# EAGLE design NanOSD (EAGLE 6.4)
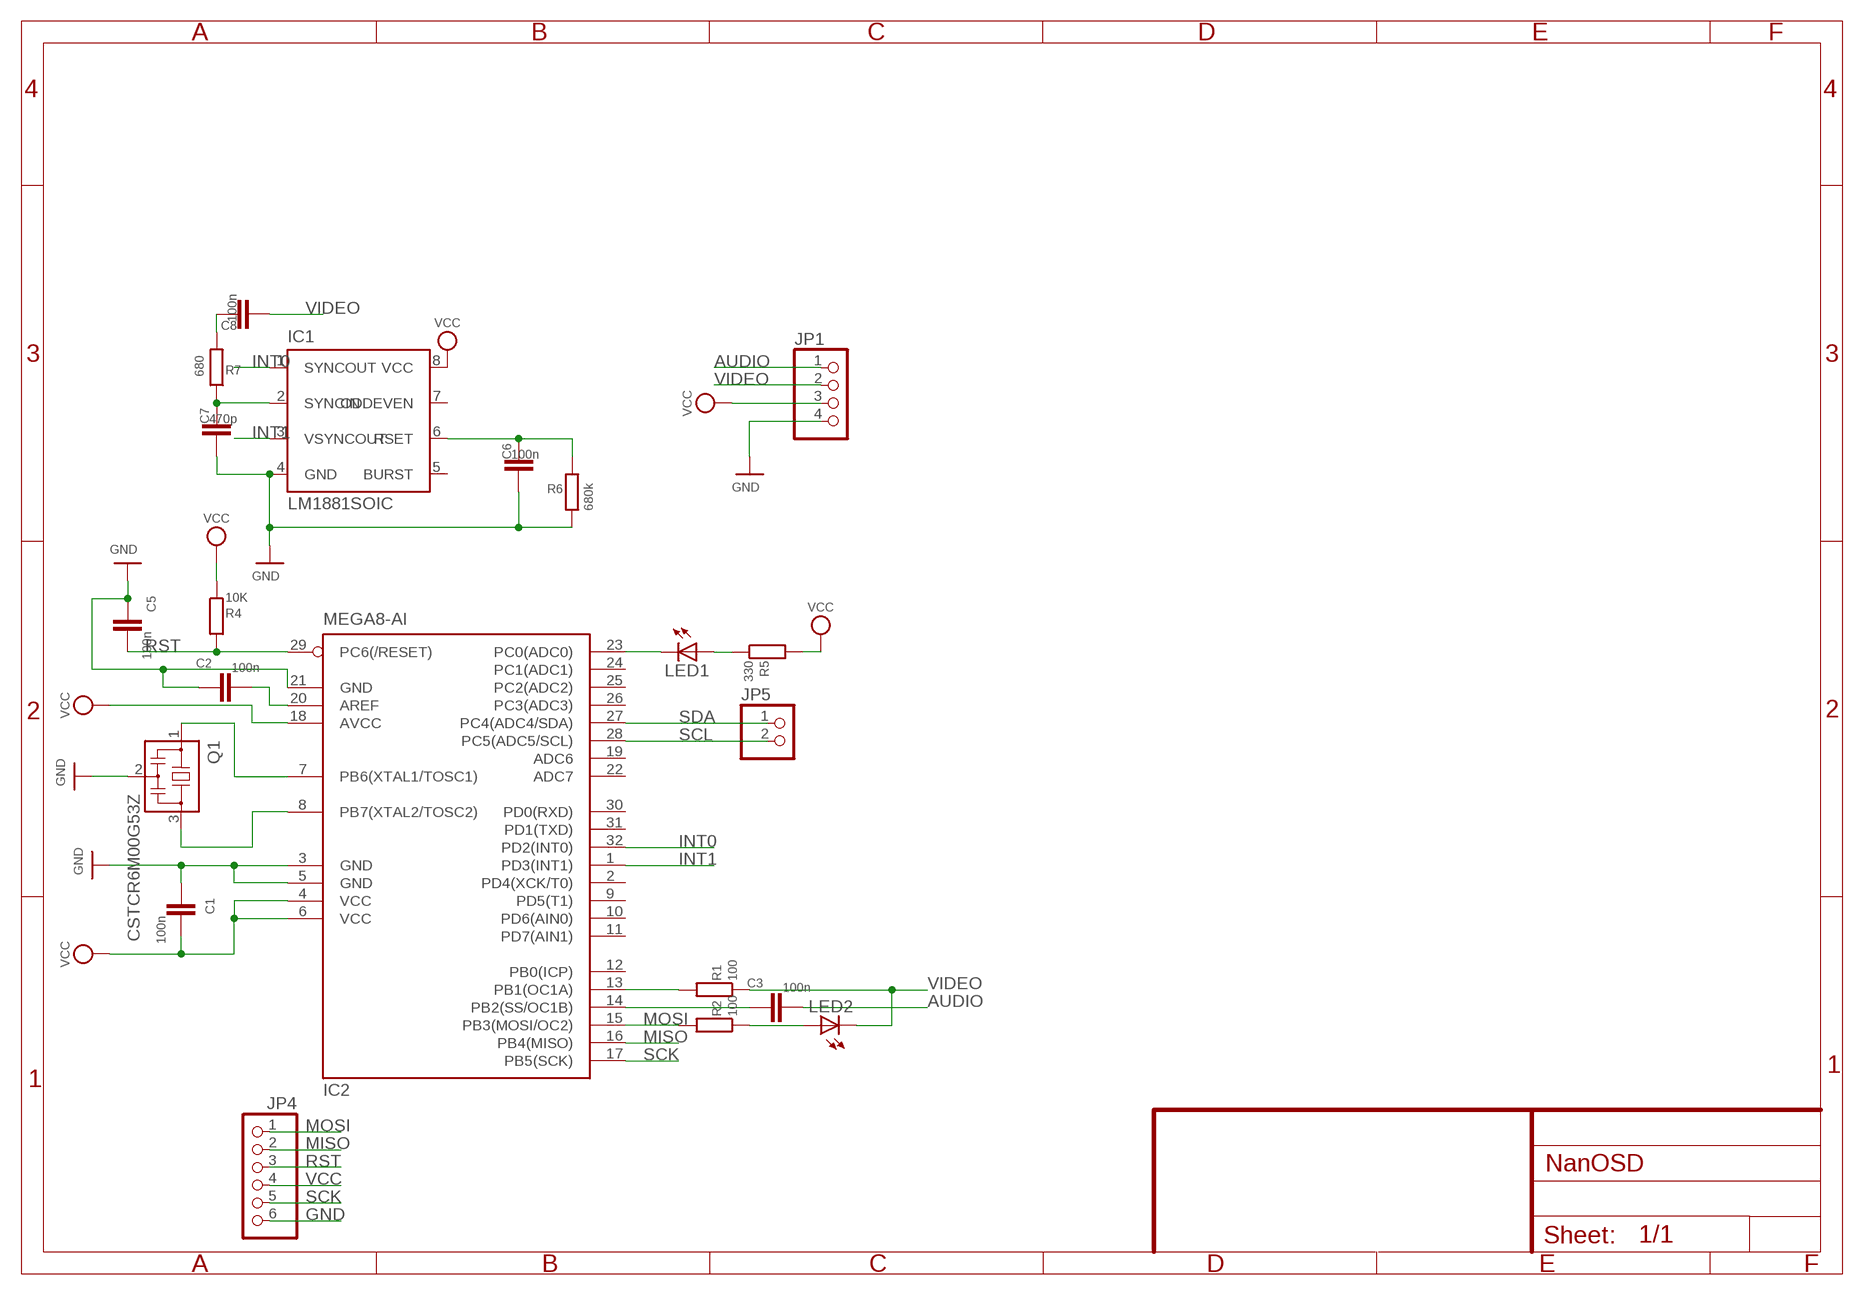
[diagram p0: schematic, sheet 1]

## Parts
C1  100n  C-EUC0805  [C0805]
C2  100n  C-EUC0805  [C0805]
C3  100n  C-EUC0805  [C0805]
C5  100n  C-EUC0805  [C0805]
C6  100n  C-EUC0805  [C0805]
C7  470p  C-EUC0805  [C0805]
C8  100n  C-EUC0805  [C0805]
IC1  LM1881SOIC  [SO08]
IC2  MEGA8-AI  [TQFP32-08]
JP1  PINHD-1X4  [1X04]
JP4  PINHD-1X61.27MM  [1X06]
JP5  PINHD-1X2  [1X02]
LED1  LEDCHIP-LED0805  [CHIP-LED0805]
LED2  LEDCHIP-LED0805  [CHIP-LED0805]
Q1  CSTCR6M00G53Z  [CSTCR6M]
R1  100  R-EU_M0805  [M0805]
R2  100  R-EU_M0805  [M0805]
R4  10K  R-EU_M0805  [M0805]
R5  330  R-EU_M0805  [M0805]
R6  680k  R-EU_M0805  [M0805]
R7  680  R-EU_M0805  [M0805]

## Nets
AUDIO: C3.2 JP1.1
GND: C1.1 C2.1 C5.1 C6.1 C7.1 IC1.4(GND) IC2.3(GND) IC2.5(GND) IC2.21(GND) JP1.4 JP4.6 Q1.2 R6.2
INT0: IC1.1(SYNCOUT) IC2.32(PD2(INT0))
INT1: IC1.3(VSYNCOUT) IC2.1(PD3(INT1))
MISO: IC2.16(PB4(MISO)) JP4.2
MOSI: IC2.15(PB3(MOSI/OC2)) JP4.1 R2.2
N$1: IC2.23(PC0(ADC0)) LED1.C
N$2: LED1.A R5.1
N$3: C6.2 IC1.6(RSET) R6.1
N$4: C7.2 IC1.2(SYNCIN) R7.1
N$5: IC2.13(PB1(OC1A)) R1.2
N$6: C8.2 R7.2
N$7: IC2.7(PB6(XTAL1/TOSC1)) Q1.1
N$8: LED2.A R2.1
N$9: IC2.8(PB7(XTAL2/TOSC2)) Q1.3
N$10: C3.1 IC2.14(PB2(SS/OC1B))
N$11: C2.2 IC2.20(AREF)
RST: C5.2 IC2.29(PC6(/RESET)) JP4.3 R4.2
SCK: IC2.17(PB5(SCK)) JP4.5
SCL: IC2.28(PC5(ADC5/SCL)) JP5.2
SDA: IC2.27(PC4(ADC4/SDA)) JP5.1
VCC: C1.2 IC1.8(VCC) IC2.4(VCC) IC2.6(VCC) IC2.18(AVCC) JP1.3 JP4.4 R4.1 R5.2
VIDEO: C8.1 JP1.2 LED2.C R1.1
Unconnected: IC1.5(BURST) IC1.7(ODDEVEN) IC2.2(PD4(XCK/T0)) IC2.9(PD5(T1)) IC2.10(PD6(AIN0)) IC2.11(PD7(AIN1)) IC2.12(PB0(ICP)) IC2.19(ADC6) IC2.22(ADC7) IC2.24(PC1(ADC1)) IC2.25(PC2(ADC2)) IC2.26(PC3(ADC3)) IC2.30(PD0(RXD)) IC2.31(PD1(TXD))

## Library data of the parts
C1-C3 C5-C8 = rcl:C-EU: CAPACITOR, European symbol
IC1 = lm1881:LM1881
IC2 = atmel:MEGA8: MICROCONTROLLER 8 Kbytes FLASH, 1 kbytes SRAM, 512 bytes EEPROM, USART, 6-channel 10 bit ADC, 2-channel 8 bit ADC Pin compatible with Atmega48, ATMega88, ATMega168 Source: avr.lbr; MPN: ATMEGA8-16AU; OC_FARNELL: 9171371; OC_NEWARK: 73M8863
JP1 = pinhead-6:PINHD-1X4: PIN HEADER
JP4 = pinhead-6:PINHD-1X6: PIN HEADER
JP5 = pinhead-6:PINHD-1X2: PIN HEADER
LED1 LED2 = led:LED: LED OSRAM: - CHIPLED LG R971, LG N971, LY N971, LG Q971, LY Q971, LO R971, LY R971 LH N974, LH R974 LS Q976, LO Q976, LY Q976 LO Q996 - Hyper CHIPLED LW Q18S LB Q993, LB Q99A, LB R99A - SideLED LS A670, LO A670, LY A670, LG A670, LP A670 LB A673, LV A673, LT A673, LW A673 LH A674 LY A675 LS A676, LA A676, LO A676, LY A676, LW A676 LS A679, LY A679, LG A679 - Hyper Micro SIDELED® LS Y876, LA Y876, LO Y876, LY Y876 LT Y87S - SmartLED LW L88C, LW L88S LB L89C, LB L89S, LG L890 LS L89K, LO L89K, LY L89K LS L896, LA L896, LO L896, LY L896 - TOPLED LS T670, LO T670, LY T670, LG T670, LP T670 LSG T670, LSP T670, LSY T670, LOP T670, LYG T670 LG T671, LOG T671, LSG T671 LB T673, LV T673, LT T673, LW T673 LH T674 LS T676, LA T676, LO T676, LY T676, LB T676, LH T676, LSB T676, LW T676 LB T67C, LV T67C, LT T67C, LS T67K, LO T67K, LY T67K, LW E67C LS E67B, LA E67B, LO E67B, LY E67B, LB E67C, LV E67C, LT E67C LW T67C LS T679, LY T679, LG T679 LS T770, LO T770, LY T770, LG T770, LP T770 LB T773, LV T773, LT T773, LW T773 LH T774 LS E675, LA E675, LY E675, LS T675 LS T776, LA T776, LO T776, LY T776, LB T776 LHGB T686 LT T68C, LB T68C - Hyper Mini TOPLED® LB M676 - Mini TOPLED Santana® LG M470 LS M47K, LO M47K, LY M47K Source: http://www.osram.convergy.de LUXEON: - LUMILED® LXK2-PW12-R00, LXK2-PW12-S00, LXK2-PW14-U00, LXK2-PW14-V00 LXK2-PM12-R00, LXK2-PM12-S00, LXK2-PM14-U00 LXK2-PE12-Q00, LXK2-PE12-R00, LXK2-PE12-S00, LXK2-PE14-T00, LXK2-PE14-U00 LXK2-PB12-K00, LXK2-PB12-L00, LXK2-PB12-M00, LXK2-PB14-N00, LXK2-PB14-P00, LXK2-PB14-Q00 LXK2-PR12-L00, LXK2-PR12-M00, LXK2-PR14-Q00, LXK2-PR14-R00 LXK2-PD12-Q00, LXK2-PD12-R00, LXK2-PD12-S00 LXK2-PH12-R00, LXK2-PH12-S00 LXK2-PL12-P00, LXK2-PL12-Q00, LXK2-PL12-R00 Source: www.luxeon.com KINGBRIGHT: KA-3528ASYC Source: www.kingbright.com
Q1 = murata-filter:CSTCR: Resonator Source: murata.co.jp; MPN: CSTCR6M00G53-R0; OC_FARNELL: 1170434; OC_NEWARK: 25M8759
R1 R2 R4-R7 = rcl:R-EU_: RESISTOR, European symbol

## Board
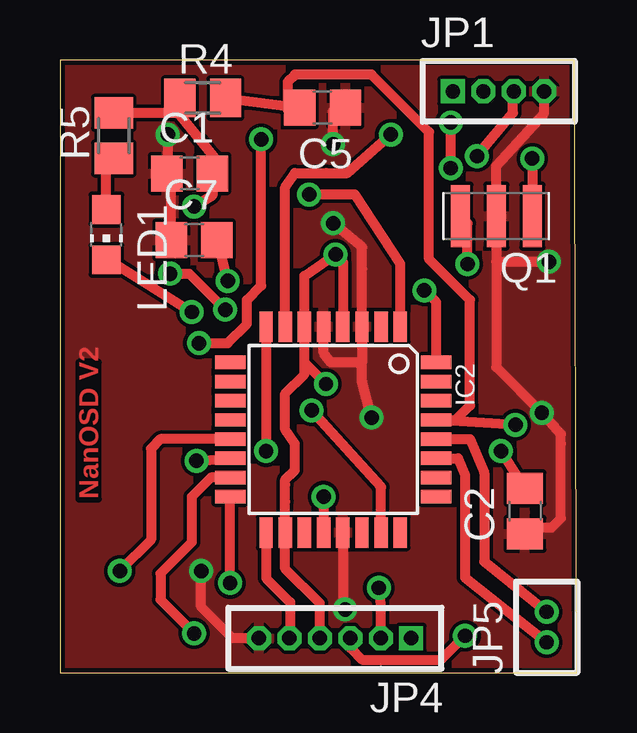
[diagram p1: board, top side]
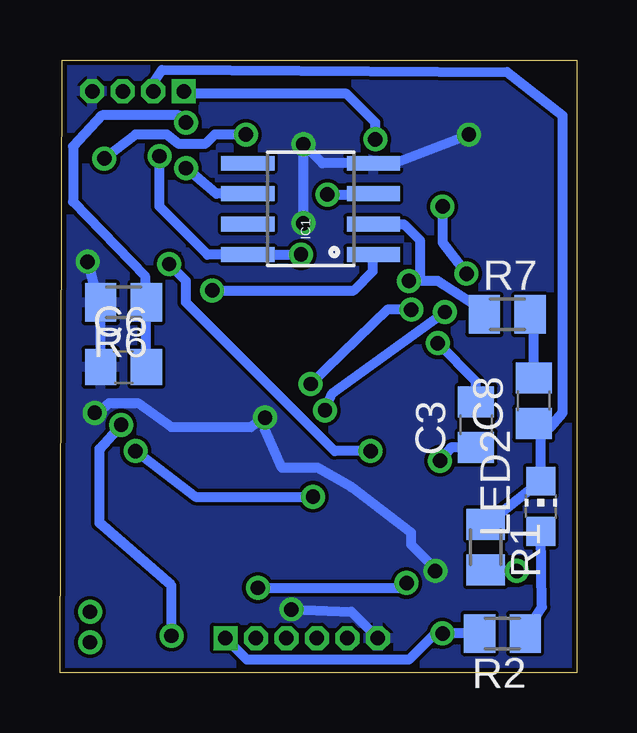
[diagram p2: board, bottom side, seen from below]

Size 21.55 x 25.55 mm. Coordinates in mm from the lower left corner, seen from the top.
Outline: 0,0 21.55,0 21.45,25.55 0,25.55 0,0
Copper layers (1*16): Top 0.035mm / dielectric 1.5mm / Bottom 0.035mm
Design rules "platinensammler_02": minimum track width 0.15mm, minimum drill 0.3mm, track to track 0.15mm, track to pad 0.15mm, pad to pad 0.15mm, via to via 0.15mm, smd to smd 0mil, copper to edge 0.2mm, drill to drill 0.2mm, minimum pad ring 0.2mm, minimum via ring 0.2mm, stop-mask expansion 4mil, vias tented up to drill 0.8mm, thermal gap 0.15mm

### Footprints (pad centres in the part's own frame; a part is rotated, then mirrored left to right if it is on the bottom)
C0805 = smd 1.3 x 1.5: 1 -0.95,0; 2 0.95,0
SO08 = smd 0.61 x 2.21: 1 -1.905,-2.616; 2 -0.635,-2.616; 3 0.635,-2.616; 4 1.905,-2.616; 5 1.905,2.616; 6 0.635,2.616; 7 -0.635,2.616; 8 -1.905,2.616
TQFP32-08 = smd 1.27 x 0.559: 1 -4.293,2.8; 2 -4.293,2; 3 -4.293,1.2; 4 -4.293,0.4; 5 -4.293,-0.4; 6 -4.293,-1.2; 7 -4.293,-2; 8 -4.293,-2.8; 17 4.293,-2.8; 18 4.293,-2; 19 4.293,-1.2; 20 4.293,-0.4; 21 4.293,0.4; 22 4.293,1.2; 23 4.293,2; 24 4.293,2.8 | smd 0.559 x 1.27: 9 -2.8,-4.293; 10 -2,-4.293; 11 -1.2,-4.293; 12 -0.4,-4.293; 13 0.4,-4.293; 14 1.2,-4.293; 15 2,-4.293; 16 2.8,-4.293; 25 2.8,4.293; 26 2,4.293; 27 1.2,4.293; 28 0.4,4.293; 29 -0.4,4.293; 30 -1.2,4.293; 31 -2,4.293; 32 -2.8,4.293
1X04 = drill 0.6 square: 1 -3.81,0 | drill 0.6 octagon: 2 -2.54,0; 3 -1.27,0; 4 0,0
1X06 = drill 0.6 square: 1 -6.35,0 | drill 0.6 octagon: 2 -5.08,0; 3 -3.81,0; 4 -2.54,0; 5 -1.27,0; 6 0,0
1X02 = drill 0.6: 1 -1.27,0; 2 0,0
CHIP-LED0805 = smd 1.2 x 1.2: A 0,-1.05; C 0,1.05
CSTCR6M = smd 0.8 x 2.6: 1 -1.5,0; 2 0,0; 3 1.5,0
M0805 = smd 1.3 x 1.6: 1 -0.95,0; 2 0.95,0

### Placement (x,y rotation side)
C1  5.41,20.82 0 top
C2  19.39,6.74 90 top
C3  4.2,10.34 90 bottom
C5  10.95,23.55 180 top
C6  18.89,12.73 0 bottom
C7  5.59,18.04 0 top
C8  1.8,11.34 90 bottom
IC1  11.09,19.34 90 bottom
IC2  11.39,10.13 270 top
JP1  20.2,24.23 0 top
JP4  8.29,1.43 180 top
JP5  20.3,2.54 90 top
LED1  1.94,18.26 180 top
LED2  1.5,6.94 0 bottom
Q1  18.2,19.04 180 top
R1  3.79,5.24 270 bottom
R2  3.1,1.64 180 bottom
R4  5.95,23.96 0 top
R5  2.25,22.39 90 top
R6  18.89,15.44 180 bottom
R7  2.9,14.94 0 bottom

### Tracks (layer width: path | path; a pad name or v marks a point on that pad's centre or on a via)
AUDIO  (via drill 0.6)
  Top 0.406: v5.79,13.73 7,13.73 7.79,14.54 7.79,15.54 8.39,16.14 v8.39,22.23
  Bottom 0.406: C3.2 4.2,12.13 v5.79,13.73 | v8.39,22.23 8.39,22.93 9.59,24.14 16.29,24.14 JP1.1
GND  (via drill 0.6)
  Top 0.406: IC2.21 11.79,2.74 v11.89,2.64 | 12.59,12.94 IC2.3 12.59,16.84 12.59,17.73 v11.39,18.73 | 12.59,12.94 12.49,12.84 12.59,12.94 | 12.59,12.94 11.29,12.94 10.99,13.34 IC2.5 | JP4.6 7.2,1.43 5.9,2.74 v5.9,4.24 | v12.99,10.63 12.59,12.13 12.59,12.94 | v11.39,22.04 11.39,23.45 C5.1 | v4.5,22.43 4.5,20.27 C1.1 4.65,20.12 C7.1 | 18.2,17.14 Q1.2 18.2,21.14 20.2,23.34 JP1.4 | 18.2,17.14 v20.39,17.14 | C2.1 19.55,6.04 20.5,6.04 20.89,6.44 20.89,9.54 20.89,9.94 v20.1,10.84 18.2,12.73 18.2,17.14
  Bottom 0.406: v11.89,2.64 9.39,2.54 JP4.6 | v5.9,4.24 5.9,4.33 6.9,5.33 6.9,5.83 9.39,7.74 10.79,8.54 12.29,8.54 12.99,10.13 v12.99,10.63 13.59,10.23 16.89,10.23 18.3,11.23 19.5,11.23 20,10.84 v20.1,10.84 | v11.39,18.73 v11.39,22.04 10.6,21.24 IC1.4 7.59,21.24 v4.5,22.43 | C6.1 R6.2 20,15.59 v20.39,17.14
  pour Bottom: -0.01,25.64 21.6,25.64 21.6,0.04 -0.01,0.04
  pour Top: -0.01,25.54 21.6,25.54 21.6,0.04 -0.01,0.04
INT0  (via drill 0.6)
  Top 0.406: IC2.32 15.69,15.44 v15.19,15.94
  Bottom 0.406: v15.19,15.94 9.29,15.94 8.49,16.73 8.49,17.41 IC1.1
INT1  (via drill 0.6)
  Top 0.406: IC2.1 14.19,17.04 12.29,19.93 v10.39,19.93
  Bottom 0.406: v10.39,19.93 8.51,19.93 IC1.3
MISO  (via drill 0.6)
  Top 0.406: JP4.2 13.38,2.85 v13.29,3.54 | v7.09,3.74 IC2.16
  Bottom 0.406: v13.29,3.54 7.29,3.54 v7.09,3.74
MOSI  (via drill 0.6)
  Top 0.406: IC2.15 6.29,8.13 5.5,7.33 5.5,5.44 4.2,4.13 4.2,3.04 v5.59,1.64
  Bottom 0.406: R2.2 5.29,1.64 | 5.29,1.64 v5.59,1.64 | v5.59,1.64 5.9,1.64 7,0.54 13.74,0.54 JP4.1 | v5.59,1.64 5.29,1.64
N$1  (via drill 0.6)
  Top 0.406: IC2.23 13.39,7.74 v10.49,10.94 | v5.5,15.04 1.96,17.23 LED1.C
  Bottom 0.406: v10.49,10.94 10.19,11.63 v5.5,15.04
N$2
  Top 0.406: LED1.A 1.94,21.13 R5.1
N$3  (via drill 0.6)
  Top 0.406: v16.3,21.04 16.3,21.93 v16.3,22.93
  Bottom 0.406: C6.2 R6.1 18,15.48 18,16.54 21,19.64 21,21.93 19.8,23.23 16.6,23.23 v16.3,22.93 | IC1.6 15.03,19.97 v16.3,21.04
N$4  (via drill 0.6)
  Top 0.406: v7,16.34 6.59,17.98 C7.2
  Bottom 0.406: R7.1 3.85,15.09 5.79,16.34 v7,16.34 6.54,16.39 C7.2 7.21,18.7 IC1.2
N$5  (via drill 0.6)
  Top 0.406: IC2.13 4.2,9.73 3.79,9.34 3.79,5.54 v2.5,4.24
  Bottom 0.406: v2.5,4.24 3.75,4.24 R1.2
N$6
  Bottom 0.406: C8.2 1.8,14.79 R7.2
N$7  (via drill 0.6)
  Top 0.406: IC2.7 9.39,20.23 9.79,20.84 10.69,20.84 11.09,20.84 11.99,20.84 v13.79,22.43 | v19.7,21.43 Q1.1
  Bottom 0.406: v13.79,22.43 15.09,22.43 15.49,22.04 16.6,22.04 17.1,22.43 18.39,22.43 v19.7,21.43
N$8
  Bottom 0.406: R2.1 1.45,2.74 LED2.A
N$9  (via drill 0.6)
  Top 0.406: IC2.8 8.59,9.44 v8.59,9.23 | v17,17.04 17,18.73 Q1.3
  Bottom 0.406: v8.59,9.23 10.09,9.23 16.3,15.44 16.3,16.34 v17,17.04
N$10  (via drill 0.6)
  Top 0.406: v5.7,8.84 IC2.14
  Bottom 0.406: C3.1 5.25,9.38 v5.7,8.84
N$11  (via drill 0.6)
  Top 0.406: C2.2 18.55,8.98 v18.39,9.23 | v10.99,7.33 IC2.20
  Bottom 0.406: v18.39,9.23 15.89,7.33 v10.99,7.33
RST  (via drill 0.6)
  Top 0.406: JP4.3 12.1,1.02 12.59,0.54 15.89,0.54 v16.89,1.53 | v19,10.34 IC2.29 16.5,10.54 17.1,11.13 17.1,15.54 15.39,17.23 15.39,22.54 12.99,24.93 9.79,24.93 9.49,24.64 9.49,23.46 C5.2 R4.2
  Bottom 0.406: v16.89,1.53 16.89,3.64 19.89,6.24 19.89,9.34 v19,10.34
SCK
  Top 0.406: IC2.17 8.59,3.94 9.59,2.94 9.59,1.46 JP4.5
SCL
  Top 0.406: IC2.28 17.1,9.73 17.7,8.34 17.7,4.63 JP5.2
SDA
  Top 0.406: IC2.27 16.6,8.94 16.89,8.23 16.89,3.97 JP5.1
VCC  (via drill 0.6)
  Top 0.406: JP4.4 10.83,2.9 9.39,4.33 IC2.18 9.39,7.13 9.39,7.83 9.39,8.04 9.79,8.44 9.79,9.54 9.39,10.13 9.39,11.63 10.19,12.44 10.19,12.94 | 10.19,12.94 IC2.6 10.19,16.04 10.19,16.54 v11.49,17.43 11.79,17.14 IC2.4 | R5.2 5.08,23.34 R4.1 5,23.23 6.4,21.54 6.4,20.27 C1.2 6.36,19.89 v5.59,19.43 | v17.39,21.54 18.89,23.34 18.89,24.21 JP1.3 | v4.59,16.64 5.4,16.64 v6.9,15.13 | v11.09,12.04 10.99,12.13 10.19,12.94
  Bottom 0.406: v11.49,17.43 v11.5,17.43 IC1.8 15.39,17.43 17.39,19.43 v17.39,21.54 | v5.59,19.43 5.59,17.93 v4.59,16.64 | v6.9,15.13 7.9,15.13 v11.09,12.04
VIDEO
  Bottom 0.406: JP1.2 17.66,24.57 17.3,25.14 2.9,25.04 0.59,23.23 0.59,10.84 1.1,10.23 1.65,10.23 C8.1 1.5,10.09 LED2.C R1.1

### Text on the board
Top: NanOSD V2